# EAGLE schematic mast_additional_board (EAGLE 9.3.0)
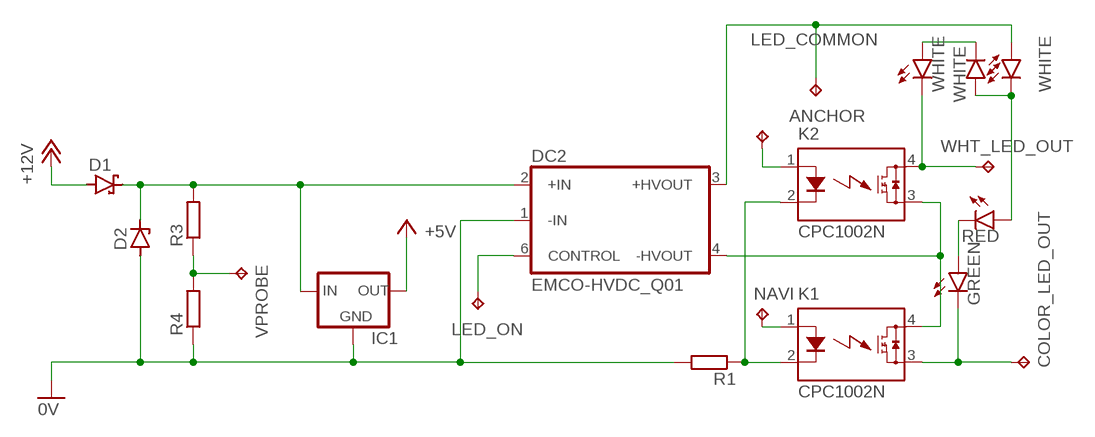
[diagram p0: schematic, sheet 1]

## Parts
ANCHOR  TPPAD1-13  [P1-13]
COLOR_LED_OUT  TPPAD1-13  [P1-13]
D1  SCHOTTKY-DIODEC4111-15  [C4111-15]
D2  ZENER-DIODEDO34-7  [DO34Z7]
DC2  EMCO-HVDC_Q01  [EMCO-HVDC-Q_100-2000V]
IC1  78LXX  [78LXX]
K1  CPC1002N  [SOIC254P610X218-4N]
K2  CPC1002N  [SOIC254P610X218-4N]
LED1  WHITE  LED5MM  [LED5MM]
LED2  WHITE  LED5MM  [LED5MM]
LED3  WHITE  LED5MM  [LED5MM]
LED5  RED  LED5MM  [LED5MM]
LED6  GREEN  LED5MM  [LED5MM]
LED_COMMON  TPPAD1-13  [P1-13]
LED_ON  TPPAD1-13  [P1-13]
NAVI  TPPAD1-13  [P1-13]
R1  R-EU_0309/12  [0309/12]
R3  R-EU_0309/12  [0309/12]
R4  R-EU_0309/12  [0309/12]
VPROBE  TPPAD1-13  [P1-13]
WHT_LED_OUT  TPPAD1-13  [P1-13]

## Nets
0V: D2.A DC2.1(-IN) IC1.GND R1.2 R4.1
+5V: IC1.OUT
+12V: D1.A
N$1: D1.C D2.C DC2.2(+IN) IC1.IN R3.2
N$2: DC2.6(CONTROL) LED_ON.TP
N$3: R3.1 R4.2 VPROBE.TP
N$4: ANCHOR.TP K2.1(A)
N$5: K1.1(A) NAVI.TP
N$6: K1.2(K) K2.2(K) R1.1
N$7: DC2.4(-HVOUT) K1.4(DS1) K2.3(DS2)
N$8: LED1.K(C) LED2.A LED5.A
N$9: LED2.K(C) LED3.A
N$10: K2.4(DS1) LED3.K(C) WHT_LED_OUT.TP
N$12: LED5.K(C) LED6.A
N$14: COLOR_LED_OUT.TP K1.3(DS2) LED6.K(C)
N$15: DC2.3(+HVOUT) LED1.A LED_COMMON.TP

## Library data of the parts
ANCHOR COLOR_LED_OUT LED_COMMON LED_ON NAVI VPROBE WHT_LED_OUT = testpad:TP: Test pad
D1 = diode:SCHOTTKY-DIODE: Schottky Diode
D2 = diode:ZENER-DIODE: Z-Diode
DC2 = dc-dc-converter:EMCO-HVDC_Q?*: Q Series of ultra-miniature, high reliability DC to HV DC converters supplying (100V - 5,000V) Source: Emco Q Series DC to HV DC Converters.pdf
IC1 = v-reg:78LXX: VOLTAGE REGULATOR
K1 K2 = misc:CPC1002N: The CPC1002N is a miniature, normally-open (1-Form-A) DC solid state relay in a 4-pin SOP package that employs optically coupled MOSFET
LED1-LED3 LED5 LED6 = led:LED: LED OSRAM: - CHIPLED LG R971, LG N971, LY N971, LG Q971, LY Q971, LO R971, LY R971 LH N974, LH R974 LS Q976, LO Q976, LY Q976 LO Q996 - Hyper CHIPLED LW Q18S LB Q993, LB Q99A, LB R99A - SideLED LS A670, LO A670, LY A670, LG A670, LP A670 LB A673, LV A673, LT A673, LW A673 LH A674 LY A675 LS A676, LA A676, LO A676, LY A676, LW A676 LS A679, LY A679, LG A679 - Hyper Micro SIDELED® LS Y876, LA Y876, LO Y876, LY Y876 LT Y87S - SmartLED LW L88C, LW L88S LB L89C, LB L89S, LG L890 LS L89K, LO L89K, LY L89K LS L896, LA L896, LO L896, LY L896 - TOPLED LS T670, LO T670, LY T670, LG T670, LP T670 LSG T670, LSP T670, LSY T670, LOP T670, LYG T670 LG T671, LOG T671, LSG T671 LB T673, LV T673, LT T673, LW T673 LH T674 LS T676, LA T676, LO T676, LY T676, LB T676, LH T676, LSB T676, LW T676 LB T67C, LV T67C, LT T67C, LS T67K, LO T67K, LY T67K, LW E67C LS E67B, LA E67B, LO E67B, LY E67B, LB E67C, LV E67C, LT E67C LW T67C LS T679, LY T679, LG T679 LS T770, LO T770, LY T770, LG T770, LP T770 LB T773, LV T773, LT T773, LW T773 LH T774 LS E675, LA E675, LY E675, LS T675 LS T776, LA T776, LO T776, LY T776, LB T776 LHGB T686 LT T68C, LB T68C - Hyper Mini TOPLED® LB M676 - Mini TOPLED Santana® LG M470 LS M47K, LO M47K, LY M47K Source: http://www.osram.convergy.de LUXEON: - LUMILED® LXK2-PW12-R00, LXK2-PW12-S00, LXK2-PW14-U00, LXK2-PW14-V00 LXK2-PM12-R00, LXK2-PM12-S00, LXK2-PM14-U00 LXK2-PE12-Q00, LXK2-PE12-R00, LXK2-PE12-S00, LXK2-PE14-T00, LXK2-PE14-U00 LXK2-PB12-K00, LXK2-PB12-L00, LXK2-PB12-M00, LXK2-PB14-N00, LXK2-PB14-P00, LXK2-PB14-Q00 LXK2-PR12-L00, LXK2-PR12-M00, LXK2-PR14-Q00, LXK2-PR14-R00 LXK2-PD12-Q00, LXK2-PD12-R00, LXK2-PD12-S00 LXK2-PH12-R00, LXK2-PH12-S00 LXK2-PL12-P00, LXK2-PL12-Q00, LXK2-PL12-R00 Source: www.luxeon.com KINGBRIGHT: KA-3528ASYC Source: www.kingbright.com
R1 R3 R4 = rcl:R-EU_: RESISTOR, European symbol; SPICEPREFIX: R